# Altium schematic sheet PIC.SchDoc
size A
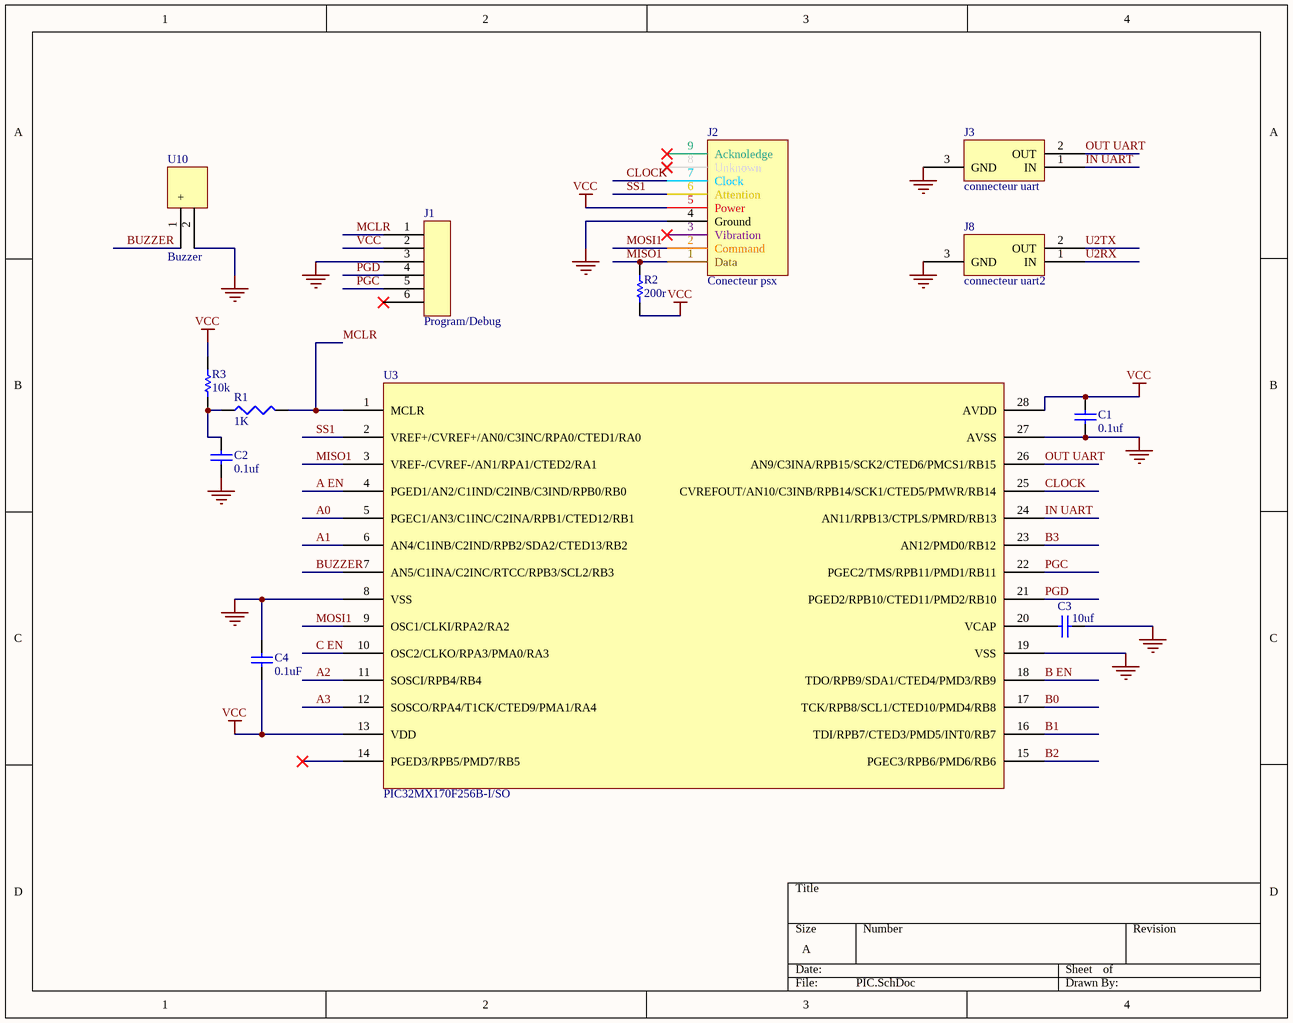
[diagram p0: PIC.SchDoc]

## Parts
C1  0.1uf  [CAPC1608X09N]
C2  0.1uf  [CAPC1608X09N]
C3  10uf  [CAPC1608X09N]
C4  0.1uF  [CAPC1608X09N]
J1  Program/Debug  [Debug]
J2  Conecteur psx  [PCBComponent_1]
J3  connecteur uart  [uart]
J8  connecteur uart2  [uart]
R1  1K  [CAPC1608X09N]
R2  200r  [CAPC1608X09N]
R3  10k  [CAPC1608X09N]
U3  PIC32MX170F256B-I/SO  [SOIC127P1030X265-28N]
U10  Buzzer  [ABT-410-RC]

## Nets
GND: C1.1 C2.1 C3.2 C4.2 J1.3 J2.4(Ground) J3.3(GND) J8.3(GND) U3.8(VSS) U3.19(VSS) U3.27(AVSS) U10.2(-)
VCC: C1.2 C4.1 J1.2 J2.5(Power) R2.1 R3.2 U3.13(VDD) U3.28(AVDD)
A0: U3.5(PGEC1/AN3/C1INC/C2INA/RPB1/CTED12/RB1)
A1: U3.6(AN4/C1INB/C2IND/RPB2/SDA2/CTED13/RB2)
A2: U3.11(SOSCI/RPB4/RB4)
A3: U3.12(SOSCO/RPA4/T1CK/CTED9/PMA1/RA4)
A EN: U3.4(PGED1/AN2/C1IND/C2INB/C3IND/RPB0/RB0)
B0: U3.17(TCK/RPB8/SCL1/CTED10/PMD4/RB8)
B1: U3.16(TDI/RPB7/CTED3/PMD5/INT0/RB7)
B2: U3.15(PGEC3/RPB6/PMD6/RB6)
B3: U3.23(AN12/PMD0/RB12)
B EN: U3.18(TDO/RPB9/SDA1/CTED4/PMD3/RB9)
BUZZER: U3.7(AN5/C1INA/C2INC/RTCC/RPB3/SCL2/RB3) U10.1(+)
C EN: U3.10(OSC2/CLKO/RPA3/PMA0/RA3)
CLOCK: J2.7(Clock) U3.25(CVREFOUT/AN10/C3INB/RPB14/SCK1/CTED5/PMWR/RB14)
IN UART: J3.1(IN) U3.24(AN11/RPB13/CTPLS/PMRD/RB13)
MCLR: J1.1 R1.2 U3.1(MCLR)
MISO1: J2.1(Data) R2.2 U3.3(VREF-/CVREF-/AN1/RPA1/CTED2/RA1)
MOSI1: J2.2(Command) U3.9(OSC1/CLKI/RPA2/RA2)
OUT UART: J3.2(OUT) U3.26(AN9/C3INA/RPB15/SCK2/CTED6/PMCS1/RB15)
PGC: J1.5 U3.22(PGEC2/TMS/RPB11/PMD1/RB11)
PGD: J1.4 U3.21(PGED2/RPB10/CTED11/PMD2/RB10)
SS1: J2.6(Attention) U3.2(VREF+/CVREF+/AN0/C3INC/RPA0/CTED1/RA0)
U2RX: J8.1(IN)
U2TX: J8.2(OUT)
NetC2_2: C2.2 R1.1 R3.1
NetC3_1: C3.1 U3.20(VCAP)

Not connected (* = marked no-connect by the designer): J1 6*; J2 3(Vibration)* 8(Unknown)* 9(Acknoledge)*; U3 14(PGED3/RPB5/PMD7/RB5)*

## Library data of the parts
C1-C4 = Cap: Capacitor; Published: 8-Jun-2000; LatestRevisionDate: 17-Jul-2002; LatestRevisionNote: Re-released for DXP Platform.; PackageReference: RAD-0.3; Publisher: Altium Limited; PackageDescription: Radial Cap, Thru-Hole; 2 Leads; 0.3 in Pin Spacing
  C1 C2 C4: Value: 0.1uf
  C3: Value: 10uf
J1 = Component_1: fournisseur: Farnell; Ref fabricant: 640456-6; Ref fournisseur: 588611
J2 = Component_1: Ref fabricant: 3041438; Ref fournisseur: 1725711; fournisseur: Farnell
J3 J8 = connecteur uart: Ref fournisseur: 1725669; fournisseur: Farnell; Ref fabricant: 3041360
R1 = Res3: Resistor; Published: 8-Jun-2000; LatestRevisionDate: 29-May-2009; LatestRevisionNote: IPC-7351 Footprint Added.; PackageReference: J1-0603; Publisher: Altium Limited; PackageDescription: Chip Resistor; Value: 1K
R2 R3 = Res1: Resistor; Value: 1K; Published: 8-Jun-2000; LatestRevisionDate: 17-Jul-2002; LatestRevisionNote: Re-released for DXP Platform.; PackageReference: AXIAL-0.3; Publisher: Altium Limited; PackageDescription: Axial Device, Thru-Hole; 2 Leads; 0.3 in Pin Spacing
U3 = PICMX1XX: fournisseur: Farnell; Ref fournisseur: 2449077; Ref fabricant: PIC32MX170F256B-I/SO
U10 = Buzzer: fournisseur: Farnell; Ref fournisseur: 1022402; Ref fabricant: ABT-410-RC